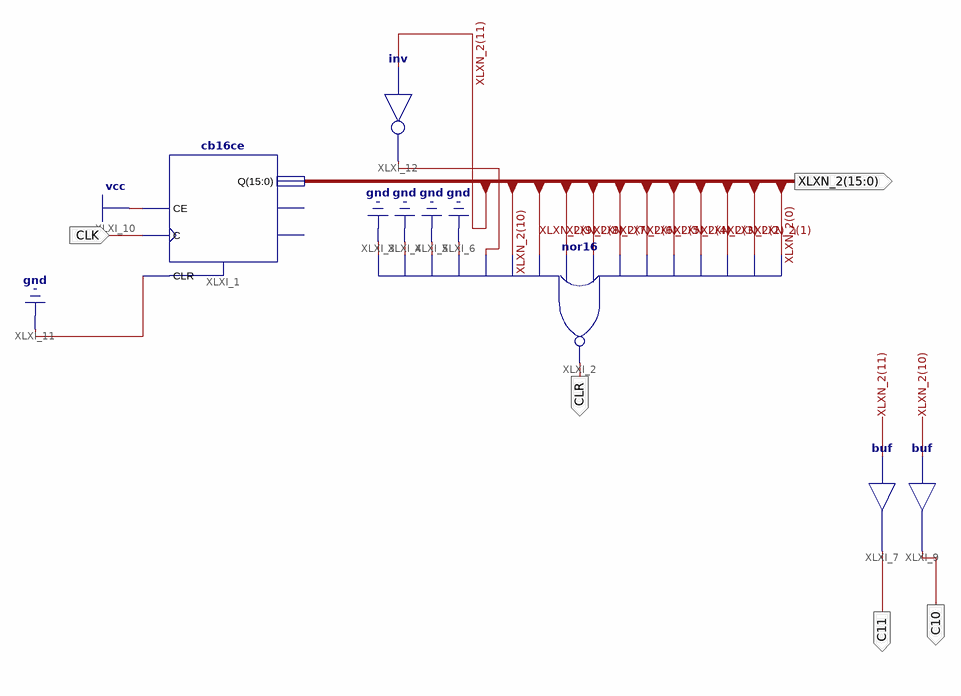
[diagram p0: schematic sheet 1]
// Xilinx ISE schematic Counter_12.sch (spartan3) as structural Verilog: 5 symbols, 5 ports
module Counter_12 (
  input  CLK,
  output [15:0] XLXN_2,
  output CLR,
  output C11,
  output C10
);

  wire XLXN_43;

  cb16ce XLXI_1 (.C(CLK), .CE(1'b1), .CLR(1'b0), .Q(XLXN_2));  // open: CEO, TC
  buf XLXI_7 (C11, XLXN_2[11]);
  buf XLXI_9 (C10, XLXN_2[10]);
  nor XLXI_2 (CLR, 1'b0, 1'b0, 1'b0, 1'b0, XLXN_43, XLXN_2[10], XLXN_2[9], XLXN_2[8], XLXN_2[7], XLXN_2[6], XLXN_2[5], XLXN_2[4], XLXN_2[3], XLXN_2[2], XLXN_2[1], XLXN_2[0]);
  not XLXI_12 (XLXN_43, XLXN_2[11]);
endmodule
